# Altium project USB_Scope_Analog_Front_End.PrjPcb
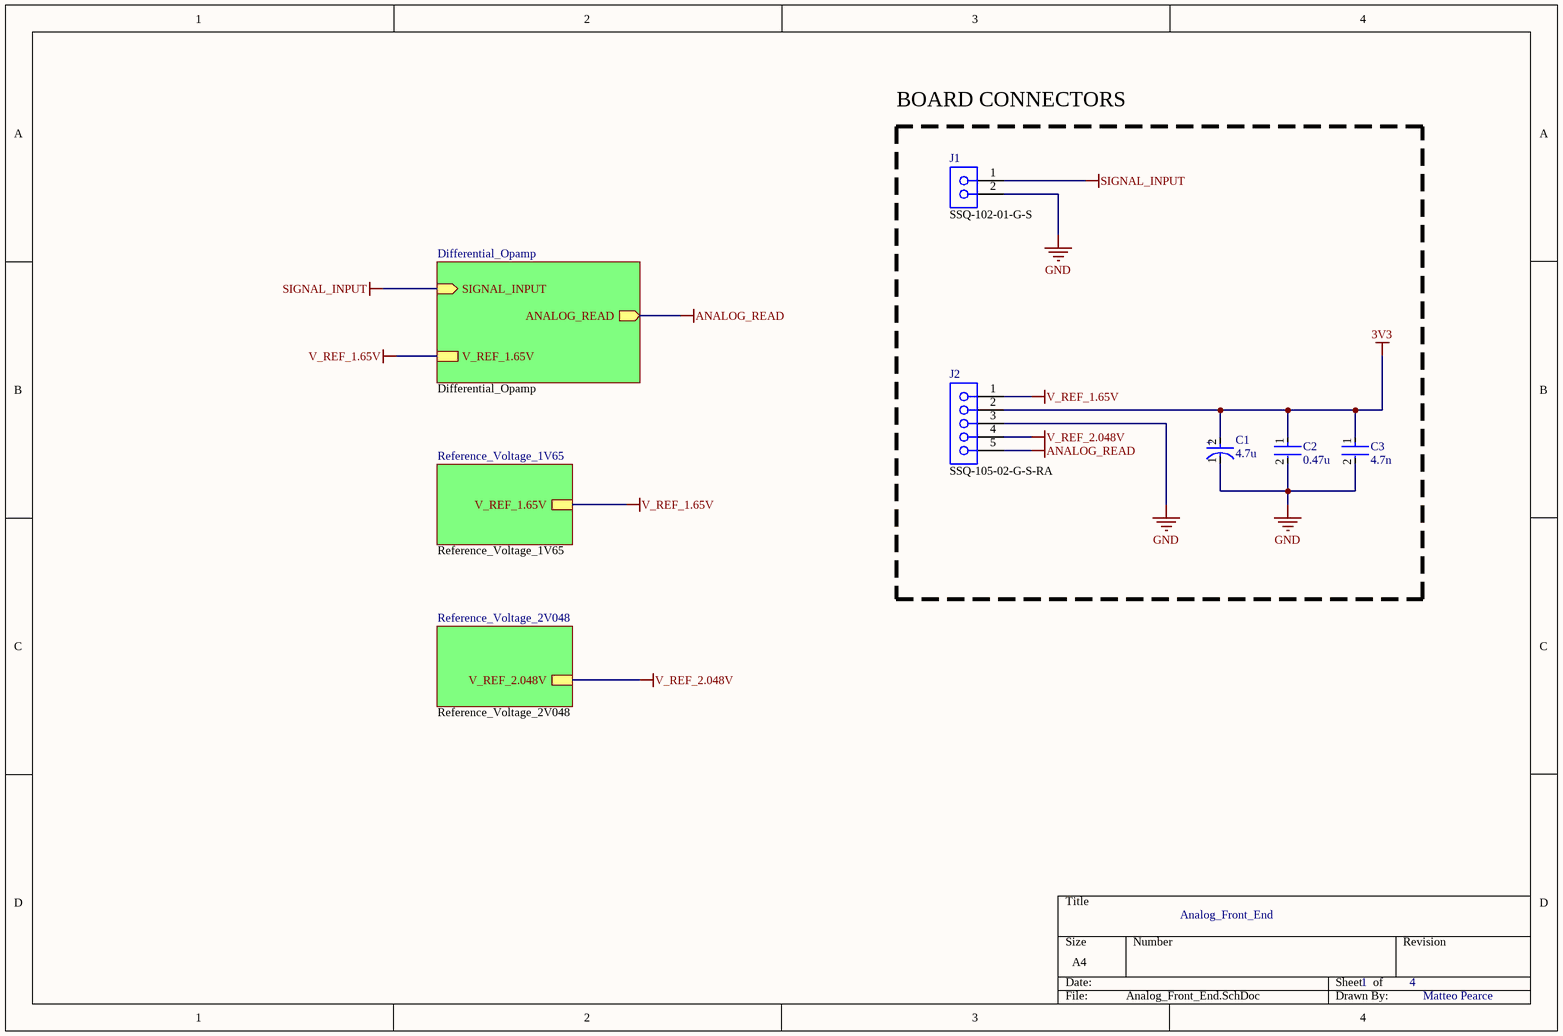
[diagram p0: Analog_Front_End.SchDoc]
4 sheets, 22 parts. Net scope: hierarchical (ports join the sheet entries above them; power ports are global).
Board file: PCB.PcbDoc
Sheets:
  Analog_Front_End.SchDoc
    Reference_Voltage_1V65 = Reference_Voltage_1V65.SchDoc
    Reference_Voltage_2V048 = Reference_Voltage_2V048.SchDoc
    Differential_Opamp = Differential_Opamp.SchDoc

## Sheet Analog_Front_End.SchDoc
size A4; SheetNumber: 1; SheetTotal: 4

### Parts
C1  4.7u  [FP-TAJA-MFG]
C2  0.47u  [FP-GCM188-0_1-IPC_A]
C3  4.7n  [FP-CC0805-0_85-MFG]
J1  SSQ-102-01-G-S  [SMTC-SSQ-102-01-X-S]
J2  SSQ-105-02-G-S-RA  [SMTC-SSQ-105-02-X-S-RA]

### Blocks framed on the sheet
BOARD CONNECTORS: C1-C3 J1 J2

### Sub-sheets
Differential_Opamp = Differential_Opamp: ANALOG_READ (out), SIGNAL_INPUT (in), V_REF_1.65V
Reference_Voltage_1V65 = Reference_Voltage_1V65: V_REF_1.65V
Reference_Voltage_2V048 = Reference_Voltage_2V048: V_REF_2.048V

### Nets
3V3: C1.2(A) C2.1 C3.1 J2.2
ANALOG_READ: J2.5 ; sheet Differential_Opamp/ANALOG_READ
GND: C1.1(C) C2.2 C3.2 J1.2 J2.3
SIGNAL_INPUT: J1.1 ; sheet Differential_Opamp/SIGNAL_INPUT
V_REF_1.65V: J2.1 ; sheet Reference_Voltage_1V65/V_REF_1.65V, sheet Differential_Opamp/V_REF_1.65V
V_REF_2.048V: J2.4 ; sheet Reference_Voltage_2V048/V_REF_2.048V

### Notes on the sheet
- Analog_Front_End
- 1
- 4
- Matteo Pearce
- (in symbol CMP-04424-000323-2) +

### Library data of the parts
C1 = CMP-04424-000323-2: 4.7uF 20V  ±10% 4Ω 1206  SMD Tantalum Capacitor; NexarPartId: 39985789; Q Factor: 6; Ripple Current: 137mA; Life (Hours): 2000hours; Dissipation Factor: 6%; Capacitance: 4.7µF; Leakage Current: 900nA; Polarity: Polar; Case Code (Imperial): 1206; Min Operating Temperature: -55°C; Length: 3.2mm; Lead Free: Lead Free; Width: 1.6mm; REACH SVHC: No SVHC; ESR (Equivalent Series Resistance): 4Ω; Lead Pitch: 1.1mm; RoHS: Compliant; Voltage Rating: 20V; Packaging: Cut Tape (CT); Height: 1.6mm; Dielectric Material: Tantalum; Voltage Rating (DC): 20V; Number of Pins: 2; Max Operating Temperature: 125°C; Height - Seated (Max): 1.8034mm; Schedule B: 8532210050; Lifecycle Status: Production; Depth: 1.6mm; Radiation Hardening: No; Case/Package: 1206; Features: General Purpose; Case Code (Metric): 3216; Tolerance: 10%; Termination: SMD/SMT; Voltage: 20V; Mount: PCB, Surface Mount
C2 = CMP-2006-02360-2: Ceramic Capacitor for Automotive 470nF  ±10% 16VDC X7R 0603 Paper T/R; Voltage: 16V; Max Operating Temperature: 125°C; Lead Free: Lead Free; Termination: SMD/SMT; Packaging: Tape and Reel; Width: 0.8mm; Mount: Surface Mount; Height: 0.8mm; Package Quantity: 1; Voltage Rating (DC): 16V; Length: 1.6mm; Dielectric: X7R; Case/Package: 0603; Voltage Rating: 16V; REACH SVHC: No SVHC; Thickness: 0.035inch; Min Operating Temperature: -55°C; Tolerance: 10%; Capacitance: 470nF; Depth: 0.8mm; Radiation Hardening: No; Case Code (Metric): 1608; Case Code (Imperial): 0603; Ratings: AEC-Q200
C3 = CMP-03422-000052-1: CAP CER 0.047UF 50V X7R 0805; Manufacturer Part Number: CC0805KRX7R9BB473; Manufacturer: Yageo; Description: CC0805 47 nF X7R 10.00% 50 V; Value: 47 nF; Tolerance: 0.1; Material: Ceramic; Footprint Url: http://www.yageo.com/exep/pages/download/literatures/UPY-C_GEN_24.pdf; ComponentLink2URL: http://www.yageo.com/documents/recent/UPY-GPHC_Y5V_6.3V-to-50V_8.pdf; Ipc Land Pattern Name: CAPC200125X85; Digikey Description: CAP CER 0.047UF 50V X7R 0805; Lead Free: Yes; Octopart: https://octopart.com/cc0805krx7r9bb473-yageo-42181304; Voltage Rating: 50 V; RoHS: TRUE; ComponentLink2Description: Datasheet; Temperature Range High: +85°C; Package: CC0805-0.85; Temperature Range Low: -30°C; Device Class L2: Capacitors; Device Class L3: Ceramic Capacitors; Height: 0.95mm; Temperature: -30°C to +85°C; Category: Cap; Device Class L1: Passive Components; Capacitance: 47 nF; Temperature Characteristic: X7R; Automotive: No; Mouser Description: Multilayer Ceramic Capacitors MLCC - SMD/SMT 47nF 50V X7R 10%
J1 = CMP-1023-00275-1: SQ Post Socket, Through-hole, Vertical, -55 to 125 degC, 2.54 mm Pitch, 2-Pin, Female, RoHS; Manufacturer: Samtec; Pitch: 2.54 mm; ComponentLink1URL: http://www.samtec.com; ComponentLink3URL: http://www.samtec.com/documents/webfiles/cpdf/SSQ-1XX-XX-XXX-X-XX-XXX-XX-X-MKT.pdf; Temperature Range: -55 to 125 degC; PackageDescription: Assembly, Socket Strip .025[0.64] SQ Tail; RoHS: True; PackageVersion: BD, 6/1987; ComponentLink3Description: Package Specification; PackageReference: SSQ-102-01-X-S; ComponentLink2Description: Datasheet; ComponentLink2URL: http://www.samtec.com/documents/webfiles/pdf/SSQ_TH.PDF; ComponentLink1Description: Manufacturer URL; DatasheetVersion: F-214; Orientation: Vertical; Mounting Technology: Through-hole; PartNumber: SSQ-102-01-G-S
J2 = CMP-1023-00280-1: SQ Post Socket, Through-hole, Right Angle, -55 to 125 degC, 2.54 mm Pitch, 5-Pin, Female, RoHS; Manufacturer: Samtec; Pitch: 2.54 mm; DatasheetVersion: F-214; ComponentLink3Description: Package Specification; ComponentLink1URL: http://www.samtec.com; PackageReference: SSQ-105-02-X-S-RA; Temperature Range: -55 to 125 degC; ComponentLink1Description: Manufacturer URL; ComponentLink2Description: Datasheet; ComponentLink3URL: http://www.samtec.com/documents/webfiles/cpdf/SSQ-1XX-XX-XXX-X-XX-XXX-XX-X-MKT.pdf; PartNumber: SSQ-105-02-G-S-RA; PackageVersion: BD, 6/1987; PackageDescription: Assembly, Socket Strip .025[0.64] SQ Tail; Orientation: Right Angle; Mounting Technology: Through-hole; RoHS: True; ComponentLink2URL: http://www.samtec.com/documents/webfiles/pdf/SSQ_TH.PDF

## Sheet Reference_Voltage_1V65.SchDoc
size A4; SheetNumber: 3; SheetTotal: 4
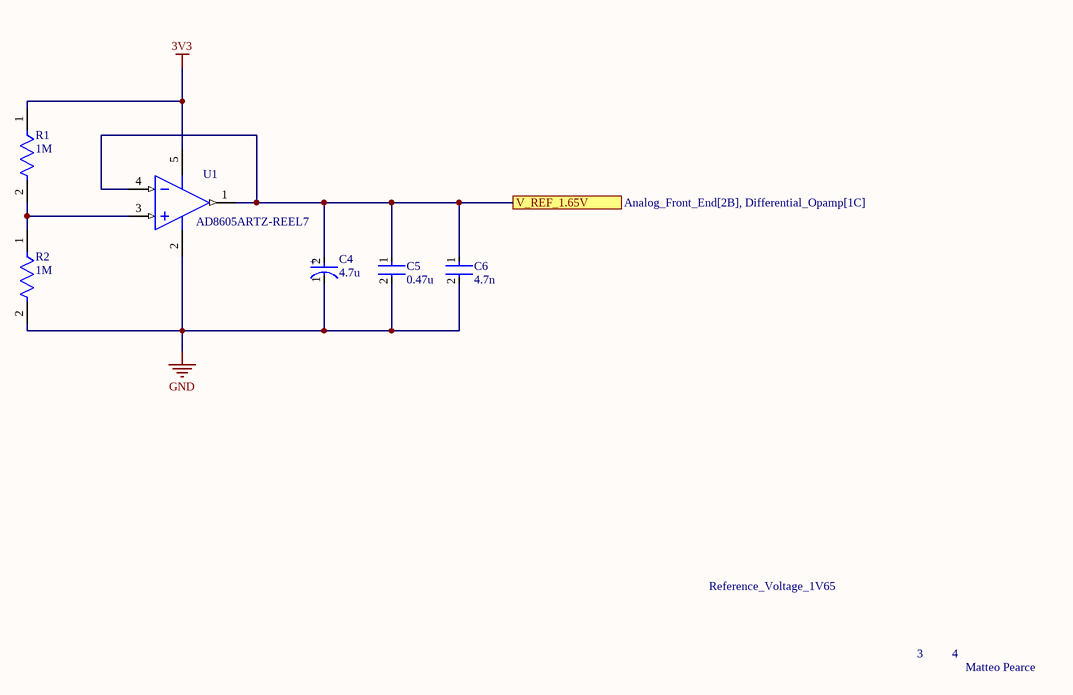
[diagram p1: Reference_Voltage_1V65.SchDoc]

### Parts
C4  4.7u  [FP-TAJA-MFG]
C5  0.47u  [FP-GCM188-0_1-IPC_A]
C6  4.7n  [FP-CC0805-0_85-MFG]
R1  1M  [FP-MCR01-IPC_B]
R2  1M  [FP-MCR01-IPC_B]
U1  AD8605ARTZ-REEL7  [ADI-RJ-5_M]

### Ports
V_REF_1.65V (see Analog_Front_End[2B], Differential_Opamp[1C])

### Nets
3V3: R1.1 U1.5(+V)
GND: C4.1(C) C5.2 C6.2 R2.2 U1.2(-V)
V_REF_1.65V: C4.2(A) C5.1 C6.1 U1.1(OUT) U1.4(-IN) ; port V_REF_1.65V
NetR1_2: R1.2 R2.1 U1.3(+IN)

### Notes on the sheet
- Reference_Voltage_1V65
- 3
- 4
- Matteo Pearce
- (in symbol CMP-04424-000323-2) +

### Library data of the parts
C4 = CMP-04424-000323-2: as C1 on sheet Analog_Front_End; Case Code (Imperial): 1206; Min Operating Temperature: -55°C; Length: 3.2mm; Lead Free: Lead Free; Width: 1.6mm; REACH SVHC: No SVHC; ESR (Equivalent Series Resistance): 4Ω; Lead Pitch: 1.1mm; RoHS: Compliant; Voltage Rating: 20V; Packaging: Cut Tape (CT); Height: 1.6mm; Dielectric Material: Tantalum; Voltage Rating (DC): 20V; Number of Pins: 2; Max Operating Temperature: 125°C; Height - Seated (Max): 1.8034mm; Schedule B: 8532210050; Lifecycle Status: Production; Depth: 1.6mm; Radiation Hardening: No; Case/Package: 1206; Features: General Purpose; Case Code (Metric): 3216; Tolerance: 10%; Termination: SMD/SMT; Voltage: 20V; Mount: PCB, Surface Mount
C5 = CMP-2006-02360-2: as C2 on sheet Analog_Front_End; Max Operating Temperature: 125°C; Lead Free: Lead Free; Termination: SMD/SMT; Packaging: Tape and Reel; Width: 0.8mm; Mount: Surface Mount; Height: 0.8mm; Package Quantity: 1; Voltage Rating (DC): 16V; Length: 1.6mm; Dielectric: X7R; Case/Package: 0603; Voltage Rating: 16V; REACH SVHC: No SVHC; Thickness: 0.035inch; Min Operating Temperature: -55°C; Tolerance: 10%; Capacitance: 470nF; Depth: 0.8mm; Radiation Hardening: No; Case Code (Metric): 1608; Case Code (Imperial): 0603; Ratings: AEC-Q200
C6 = CMP-03422-000052-1: as C3 on sheet Analog_Front_End; Footprint Url: http://www.yageo.com/exep/pages/download/literatures/UPY-C_GEN_24.pdf; ComponentLink2URL: http://www.yageo.com/documents/recent/UPY-GPHC_Y5V_6.3V-to-50V_8.pdf; Ipc Land Pattern Name: CAPC200125X85; Digikey Description: CAP CER 0.047UF 50V X7R 0805; Lead Free: Yes; Octopart: https://octopart.com/cc0805krx7r9bb473-yageo-42181304; Voltage Rating: 50 V; RoHS: TRUE; ComponentLink2Description: Datasheet; Temperature Range High: +85°C; Package: CC0805-0.85; Temperature Range Low: -30°C; Device Class L2: Capacitors; Device Class L3: Ceramic Capacitors; Height: 0.95mm; Temperature: -30°C to +85°C; Category: Cap; Device Class L1: Passive Components; Capacitance: 47 nF; Temperature Characteristic: X7R; Automotive: No; Mouser Description: Multilayer Ceramic Capacitors MLCC - SMD/SMT 47nF 50V X7R 10%
R1 R2 = CMP-08839-008209-1: Thick Film Chip Resistor, 0402, 1MΩ, 0.5%, 50ppm/°C, 0.063W, 50V; Resistance: 1MR; Power Rating: 63mW; Case/Package: 0402; RoHS Compliant: Yes; Voltage Rating (DC): 50V
U1 = CMP-0384-01494-2: Single Channel Wide Bandwidth Operational Amplifier, 10 MHz BW, 5 V/us SR, Industrial, 5-pin SOT23 (RJ-5), Reel; Manufacturer: Analog Devices; Generic Part Number: AD8605; Input Offset Voltage: 20uV; V Span Min: 2.7V; Input Bias Current: 200fA; Slew Rate: 5V/us; V Span Max: 6V; Small Signal Bandwidth: 10MHz; Amplifiers Per Package: 1; Iq/Amp: 1.2mA; ComponentLink2Description: Datasheet; PackageVersion: 121608-A; Mounting Technology: Surface Mount; ComponentLink3URL: http://www.analog.com/static/imported-files/packages/PKG_PDF/SOT-23(RJ)/RJ_5.pdf; Code_JEDEC: MO-178-AA; ComponentLink1Description: Manufacturer URL; ComponentLink4Description: Reference Circuit; RevisionNote: Reference Circuit URL fixed; PartNumber: AD8605ARTZ-REEL7; DatasheetVersion: Rev. L; PackageDescription: 5-Pin Small Outline Transistor Package, Body 2.9 x 1.6 mm, Pitch 0.95 mm; ComponentLink4URL: http://www.analog.com/en/all-operational-amplifiers-op-amps/operational-amplifiers-op-amps/ad8605/products/product.html#product-recommendations; ComponentLink3Description: Package Specification; ComponentLink1URL: http://www.analog.com/en/index.html; PackageReference: RJ-5; ComponentLink2URL: http://www.analog.com/static/imported-files/data_sheets/AD8605_8606_8608.pdf

## Sheet Reference_Voltage_2V048.SchDoc
size A4; SheetNumber: 4; SheetTotal: 4
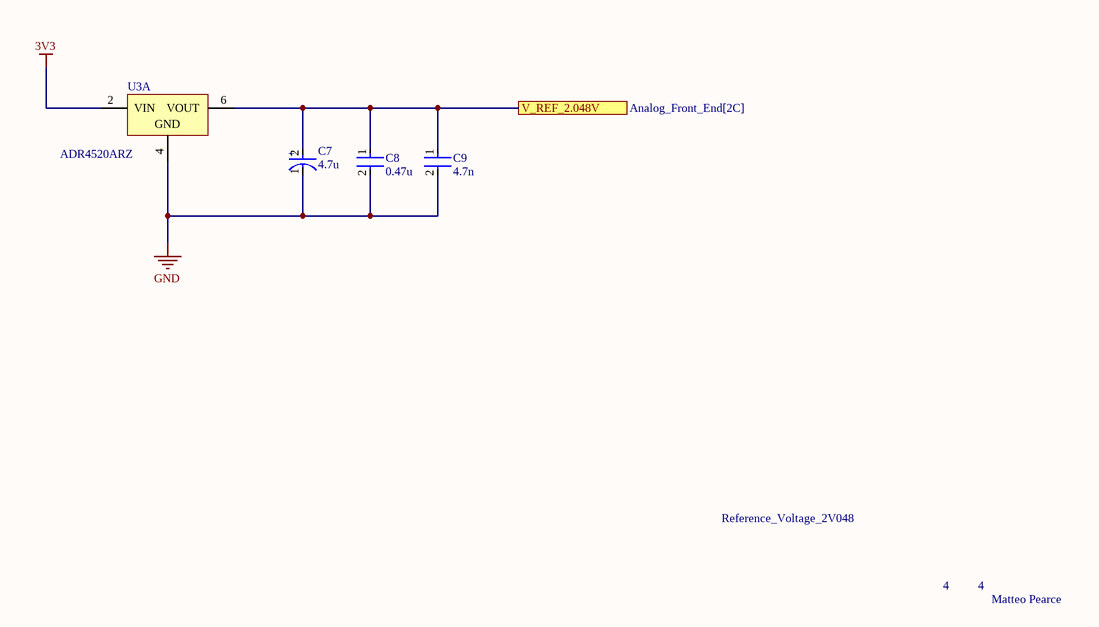
[diagram p2: Reference_Voltage_2V048.SchDoc]

### Parts
C7  4.7u  [FP-TAJA-MFG]
C8  0.47u  [FP-GCM188-0_1-IPC_A]
C9  4.7n  [FP-CC0805-0_85-MFG]
U3  ADR4520ARZ  [ADI-R-8_M]  (part A of 2)

### Ports
V_REF_2.048V (see Analog_Front_End[2C])

### Nets
3V3: U3.2(VIN)
GND: C7.1(C) C8.2 C9.2 U3.4(GND)
V_REF_2.048V: C7.2(A) C8.1 C9.1 U3.6(VOUT) ; port V_REF_2.048V

### Notes on the sheet
- Reference_Voltage_2V048
- 4
- Matteo Pearce
- (in symbol CMP-04424-000323-2) +

### Library data of the parts
C7 = CMP-04424-000323-2: as C1 on sheet Analog_Front_End; Case Code (Imperial): 1206; Min Operating Temperature: -55°C; Length: 3.2mm; Lead Free: Lead Free; Width: 1.6mm; REACH SVHC: No SVHC; ESR (Equivalent Series Resistance): 4Ω; Lead Pitch: 1.1mm; RoHS: Compliant; Voltage Rating: 20V; Packaging: Cut Tape (CT); Height: 1.6mm; Dielectric Material: Tantalum; Voltage Rating (DC): 20V; Number of Pins: 2; Max Operating Temperature: 125°C; Height - Seated (Max): 1.8034mm; Schedule B: 8532210050; Lifecycle Status: Production; Depth: 1.6mm; Radiation Hardening: No; Case/Package: 1206; Features: General Purpose; Case Code (Metric): 3216; Tolerance: 10%; Termination: SMD/SMT; Voltage: 20V; Mount: PCB, Surface Mount
C8 = CMP-2006-02360-2: as C2 on sheet Analog_Front_End; Max Operating Temperature: 125°C; Lead Free: Lead Free; Termination: SMD/SMT; Packaging: Tape and Reel; Width: 0.8mm; Mount: Surface Mount; Height: 0.8mm; Package Quantity: 1; Voltage Rating (DC): 16V; Length: 1.6mm; Dielectric: X7R; Case/Package: 0603; Voltage Rating: 16V; REACH SVHC: No SVHC; Thickness: 0.035inch; Min Operating Temperature: -55°C; Tolerance: 10%; Capacitance: 470nF; Depth: 0.8mm; Radiation Hardening: No; Case Code (Metric): 1608; Case Code (Imperial): 0603; Ratings: AEC-Q200
C9 = CMP-03422-000052-1: as C3 on sheet Analog_Front_End; Footprint Url: http://www.yageo.com/exep/pages/download/literatures/UPY-C_GEN_24.pdf; ComponentLink2URL: http://www.yageo.com/documents/recent/UPY-GPHC_Y5V_6.3V-to-50V_8.pdf; Ipc Land Pattern Name: CAPC200125X85; Digikey Description: CAP CER 0.047UF 50V X7R 0805; Lead Free: Yes; Octopart: https://octopart.com/cc0805krx7r9bb473-yageo-42181304; Voltage Rating: 50 V; RoHS: TRUE; ComponentLink2Description: Datasheet; Temperature Range High: +85°C; Package: CC0805-0.85; Temperature Range Low: -30°C; Device Class L2: Capacitors; Device Class L3: Ceramic Capacitors; Height: 0.95mm; Temperature: -30°C to +85°C; Category: Cap; Device Class L1: Passive Components; Capacitance: 47 nF; Temperature Characteristic: X7R; Automotive: No; Mouser Description: Multilayer Ceramic Capacitors MLCC - SMD/SMT 47nF 50V X7R 10%
U3 = CMP-0784-00292-1: Ultralow Noise, High Accuracy Voltage Reference, 2.048 V Output, 3 to 15 V Supply, Industrial, 8-pin SOIC (R-8), Tube; Manufacturer: Analog Devices; Min V Supply (V): 3; Max V Supply (V): 15; Ref Out TC (ppm/C): 4; Vout: 2.048V; ComponentLink2Description: Datasheet; ComponentLink2URL: http://www.analog.com/static/imported-files/data_sheets/ADR4520_4525_4530_4533_4540_4550.pdf; PartNumber: ADR4520ARZ; ComponentLink4URL: Product URL:http://www.analog.com/en/special-linear-functions/voltage-references/adr4520/products/product.html; Packing: Tube; Code_JEDEC: MS-012-AA; Operating Temp Range: -40 to 125 degC; ComponentLink1Description: Manufacturer URL; PackageVersion: 060506-A, 06/2006; ComponentLink3URL: http://www.analog.com/static/imported-files/packages/PKG_PDF/SOIC_Narrow%20(R)/R_8.pdf; ComponentLink1URL: http://www.analog.com/en/index.html; DatasheetVersion: Rev. 0; ComponentLink3Description: Package Specification; PackageReference: R-8; Mounting Technology: Surface Mount; PackageDescription: 8-Pin Standard Small Outline Package, Body 4.9 x 3.9 mm, Pitch 1.27 mm; ComponentLink4Description: URL Link1

## Sheet Differential_Opamp.SchDoc
size A4; SheetNumber: 2; SheetTotal: 4
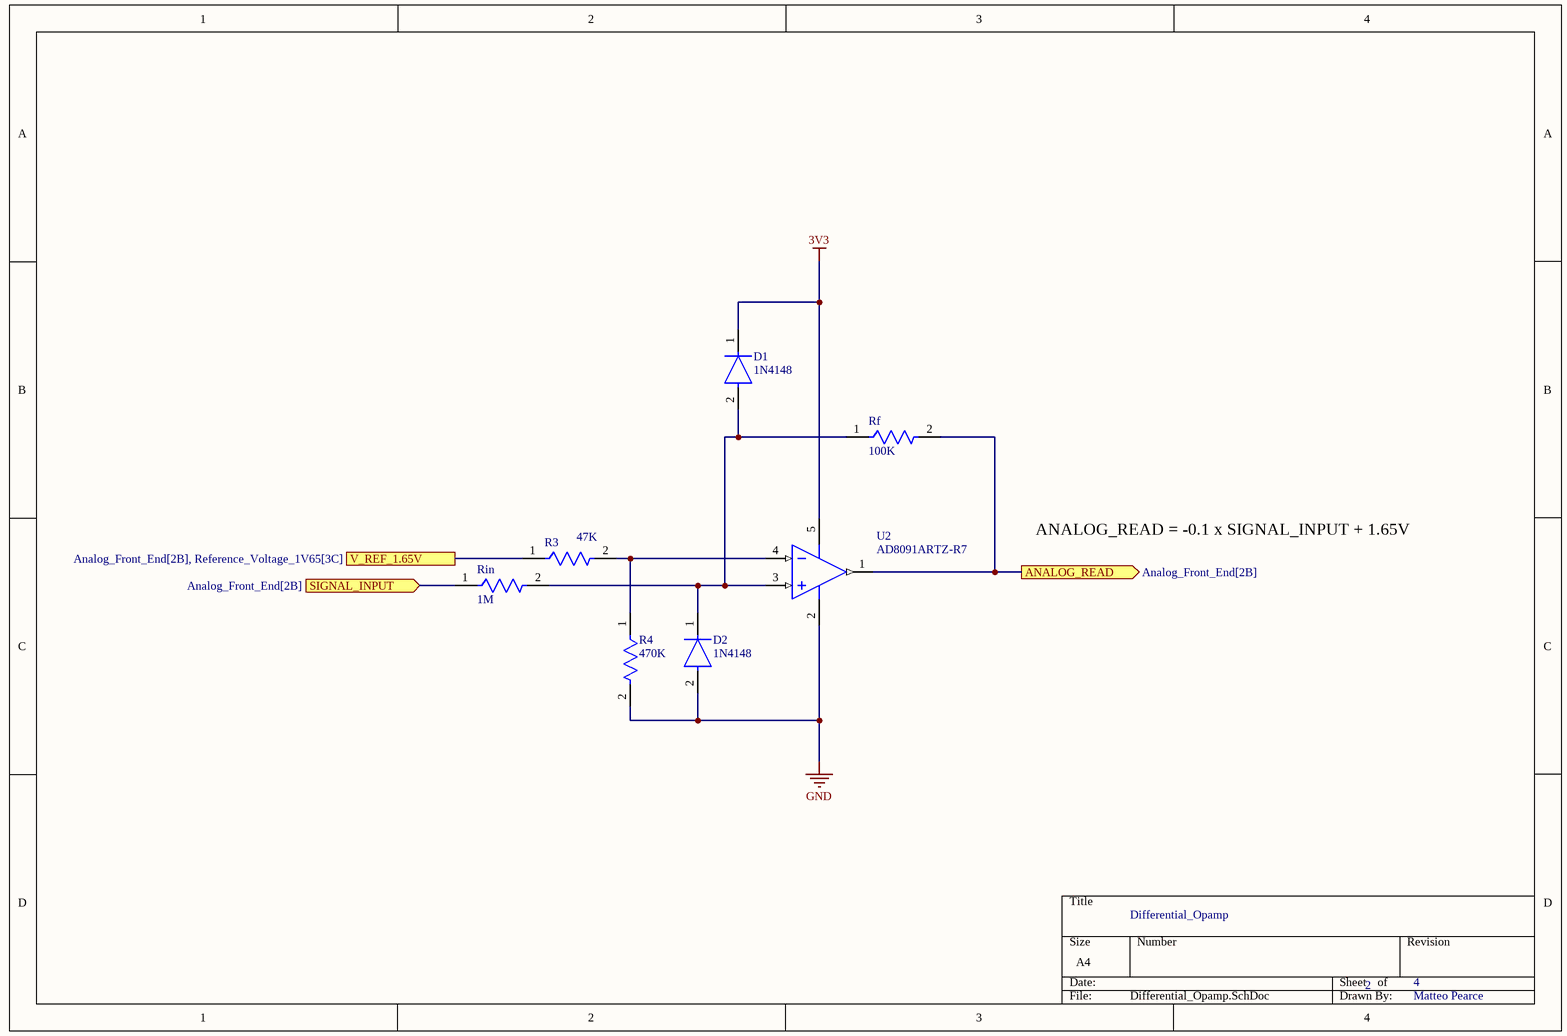
[diagram p3: Differential_Opamp.SchDoc]

### Parts
D1  1N4148  [FP-017AG-MFG]
D2  1N4148  [FP-017AG-MFG]
R3  47K  [FP-CR1206-IPC_B]
R4  470K  [FP-CR1206-IPC_C]
Rf  100K  [FP-RP73P-1J-MFG]
Rin  1M  [FP-MCR01-IPC_B]
U2  AD8091ARTZ-R7  [ADI-RJ-5_M]

### Ports
ANALOG_READ (out, see Analog_Front_End[2B]), SIGNAL_INPUT (in, see Analog_Front_End[2B]), V_REF_1.65V (see Analog_Front_End[2B], Reference_Voltage_1V65[3C])

### Nets
3V3: D1.1(C) U2.5(+VS)
ANALOG_READ: Rf.2 U2.1(VOUT) ; port ANALOG_READ
GND: D2.2(A) R4.2 U2.2(-VS)
SIGNAL_INPUT: Rin.1 ; port SIGNAL_INPUT
V_REF_1.65V: R3.1 ; port V_REF_1.65V
NetD1_2: D1.2(A) D2.1(C) Rf.1 Rin.2 U2.3(+IN)
NetR3_2: R3.2 R4.1 U2.4(-IN)

### Notes on the sheet
- ANALOG_READ = -0.1 x SIGNAL_INPUT + 1.65V
- Differential_Opamp
- 2
- 4
- Matteo Pearce

### Library data of the parts
D1 D2 = CMP-07163-000046-1: DIODE GEN PURP 100V 200MA DO35; Forward Voltage: 1V; Max Power Dissipation: 500mW; Max Reverse Current: 5uA; Forward Current: 300mA; Current: 4A; Reverse Recovery Time: 4ns; Element Configuration: Single; Outside Diameter: 1.85mm; Capacitance: 4pF; Polarity: Standard; Max Forward Surge Current (Ifsm): 1A; Reverse Voltage: 100V; Output Current: 200mA; Average Rectified Current: 200mA; Diameter: 1.91mm; Max Repetitive Reverse Voltage (Vrrm): 100V; Current Rating: 200mA; Case/Package: DO-35; Lead Free: Lead Free; Number of Pins: 2; Recovery Time: 4ns; Packaging: Bulk; Contact Plating: Tin; Voltage: 100V; Mount: Through Hole; Max Surge Current: 4A; Package Quantity: 2000; Width: 1.91mm; Max Reverse Voltage (DC): 100V; Length: 4.56mm; Radiation Hardening: No; Power Dissipation: 500mW; Voltage Rating (DC): 100V; Peak Non-Repetitive Surge Current: 4A; REACH SVHC: No SVHC; Height: 4.56mm; Max Operating Temperature: 175°C; Series: -; Weight: 0.01lb; Min Operating Temperature: -65°C
R3 = CMP-07231-000888-1: Thick Film Chip Resistors 1206 47kΩ 0.25W 1% 100ppm/°C; Max Power Dissipation: 250mW; Voltage Rating: 200V; Resistance: 47kR; Contact Plating: Tin; Length: 3.2mm; Composition: Thick Film; Mount: Surface Mount; Temperature Coefficient: 100ppm/°C; Width: 1.6mm; Min Operating Temperature: -55°C; Case Code (Imperial): 1206; Number of Terminations: 2; Military Standard: Not; Case Code (Metric): 3216; Radiation Hardening: No; Height: 0.03inch; Packaging: Tape and Reel; Voltage Rating (DC): 200V; Case/Package: 1206; REACH SVHC: No SVHC; Tolerance: 1%; Power Rating: 250mW; Max Operating Temperature: 155°C; Package Quantity: 1; Features: Moisture Resistant; Depth: 1.6mm; Termination: SMD/SMT; Thickness: 610um
R4 = CMP-07231-003544-1: Thick Film Chip Resistors 1206 470kΩ 0.25W 1% 100ppm/°C; Power Rating: 250mW; Resistance: 470kR; Voltage Rating: 200V; Case Code (Imperial): 1206; Length: 3.2mm; Case Code (Metric): 3216; Max Power Dissipation: 250mW; Temperature Coefficient: 100ppm/°C; Height: 0.03inch; Min Operating Temperature: -55°C; Tolerance: 1%; Width: 1.6mm; Termination: SMD/SMT; Max Operating Temperature: 155°C; Mount: Surface Mount; Number of Terminations: 2; Packaging: Tape and Reel; Composition: Thick Film; Depth: 1.6mm; Radiation Hardening: No; Thickness: 610um; Contact Plating: Tin; Case/Package: 1206; Military Standard: Not; Package Quantity: 5000
Rf = CMP-03211-000104-1: RES SMD 100K OHM 0.1% 1/6W 0603; Manufacturer Part Number: RP73PF1J100KBTDF; Manufacturer: TE Connectivity; Power Rating: 0.166W; Value: 100KΩ; Description: RP73P 0603 100KΩ 0.166W 25ppm/°C 0.10% 100V; Temperature Coefficient: 25ppm/°C; Tolerance: 0.001; Voltage Rating: 100V; Digikey Description: RES SMD 100K OHM 0.1% 1/6W 0603; Temperature Range High: +155°C; Ipc Land Pattern Name: RESC15580X45; Temperature: -55°C to +155°C; Series: RP73P; Height: 0.55mm; Composition: Thin Film; Automotive: No; Temperature Range Low: -55°C; Resistance: 100KΩ; Package: RP73P-1J; RoHS: TRUE; Octopart: https://octopart.com/rp73pf1j100kbtdf-te+connectivity-23826702; Category: Res; Lead Free: Yes; Device Class L2: Resistors; ComponentLink2Description: Datasheet; ComponentLink2URL: https://www.te.com/commerce/DocumentDelivery/DDEController?Action=srchrtrv&DocNm=1773272&DocType=DS&DocLang=English; Device Class L3: Chip SMD Resistors; Device Class L1: Passive Components
Rin = CMP-08839-008209-1: as R1 on sheet Reference_Voltage_1V65; Case/Package: 0402; RoHS Compliant: Yes; Voltage Rating (DC): 50V
U2 = CMP-0384-01537-2: Single Channel Single-Supply Operation Operational Amplifier, 110 MHz BW, 170 V/us SR, Industrial, 5-pin SOT23 (RJ-5), Reel; Manufacturer: Analog Devices; Generic Part Number: AD8091; V Span Min: 3V; Input Offset Voltage: 1.6mV; Small Signal Bandwidth: 110MHz; Amplifiers Per Package: 1; V Span Max: 12V; Input Bias Current: 1.3uA; Iq/Amp: 5.5mA; RevisionNote: Symbol corrected, Pin 2 orientation reversed; PackageReference: RJ-5; DatasheetVersion: Rev. C; Mounting Technology: Surface Mount; ComponentLink3URL: http://www.analog.com/static/imported-files/packages/PKG_PDF/SOT-23(RJ)/RJ_5.pdf; PackageVersion: 121608-A; ComponentLink2Description: Datasheet; ComponentLink2URL: http://www.analog.com/static/imported-files/data_sheets/AD8091_8092.pdf; ComponentLink1URL: http://www.analog.com/en/index.html; ComponentLink3Description: Package Specification; Code_JEDEC: MO-178-AA; PartNumber: AD8091ARTZ-R7; PackageDescription: 5-Pin Small Outline Transistor Package, Body 2.9 x 1.6 mm, Pitch 0.95 mm; Slew Rate: 170V/us; ComponentLink1Description: Manufacturer URL

## Nets that join several sheets
3V3: Analog_Front_End (C1.2 C2.1 C3.1 J2.2), Reference_Voltage_1V65 (R1.1 U1.5), Reference_Voltage_2V048 (U3.2), Differential_Opamp (D1.1 U2.5)
ANALOG_READ: Analog_Front_End (J2.5), Differential_Opamp (Rf.2 U2.1)
GND: Analog_Front_End (5 pins), Reference_Voltage_1V65 (5 pins), Reference_Voltage_2V048 (C7.1 C8.2 C9.2 U3.4), Differential_Opamp (D2.2 R4.2 U2.2)
SIGNAL_INPUT: Analog_Front_End (J1.1), Differential_Opamp (Rin.1)
V_REF_1.65V: Analog_Front_End (J2.1), Reference_Voltage_1V65 (5 pins), Differential_Opamp (R3.1)
V_REF_2.048V: Analog_Front_End (J2.4), Reference_Voltage_2V048 (C7.2 C8.1 C9.1 U3.6)